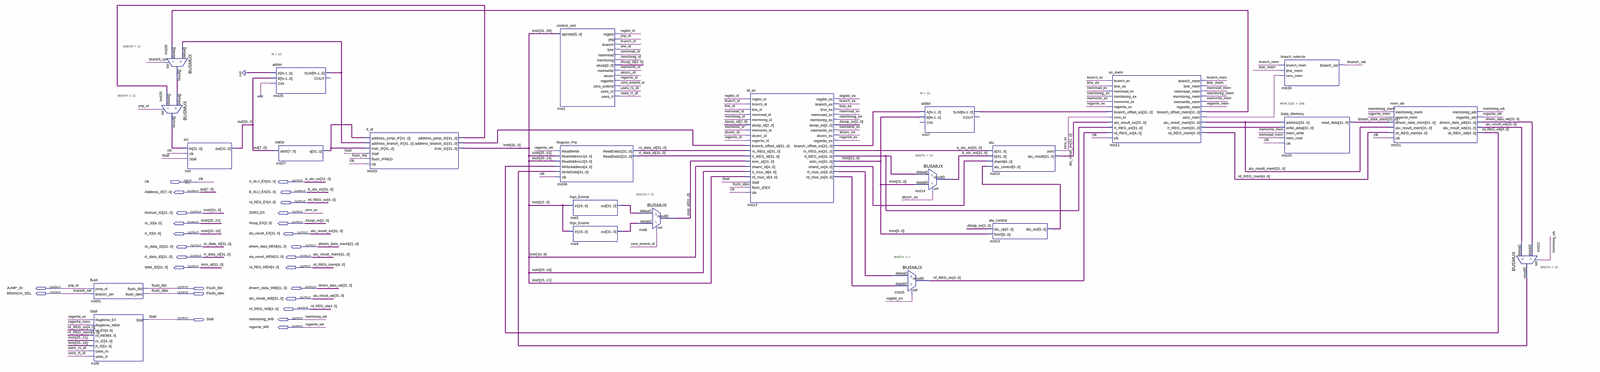
[diagram p0: schematic sheet, whole]
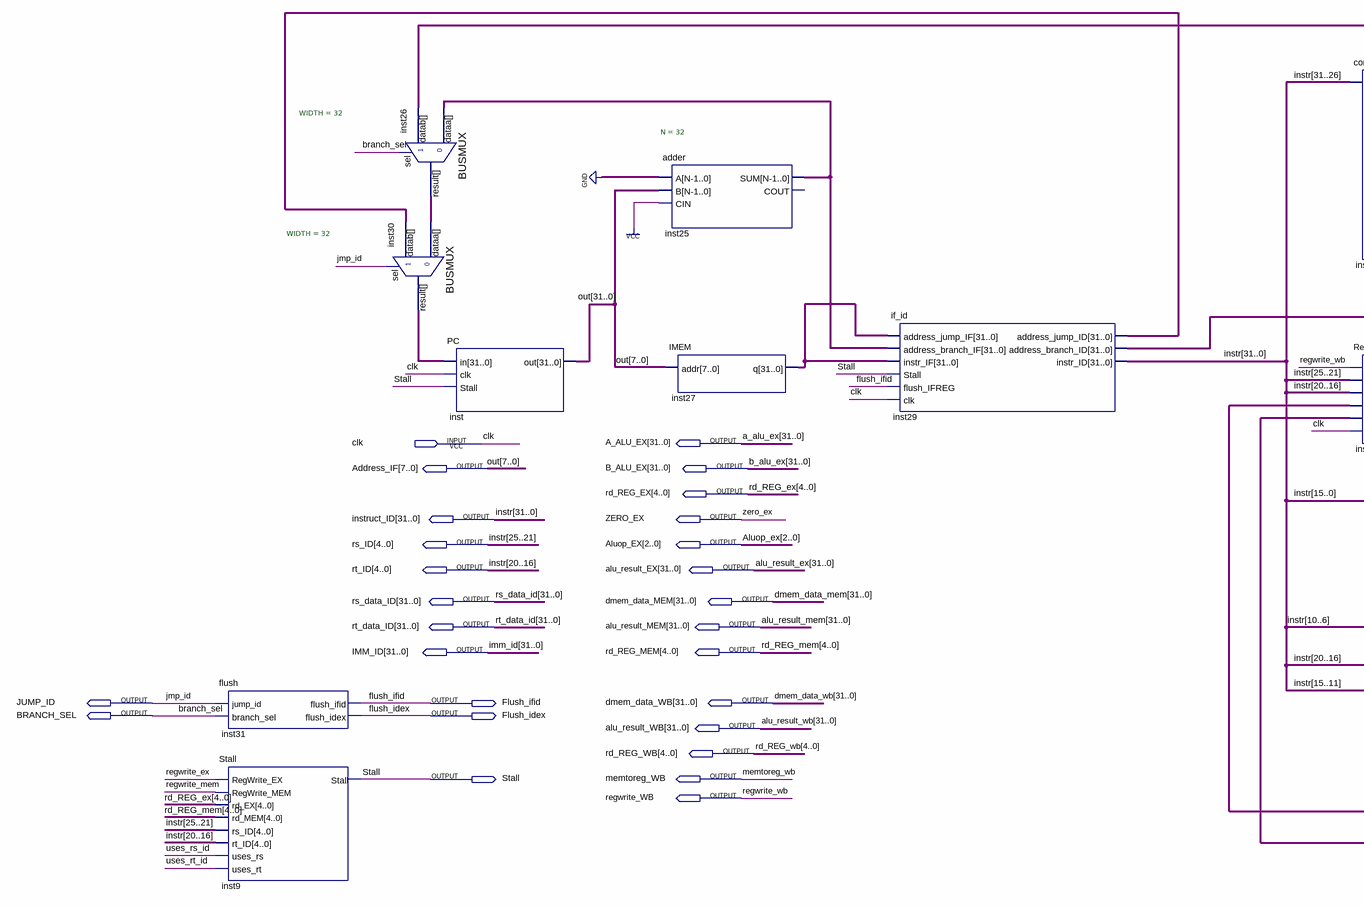
[diagram p1: schematic sheet, left part]
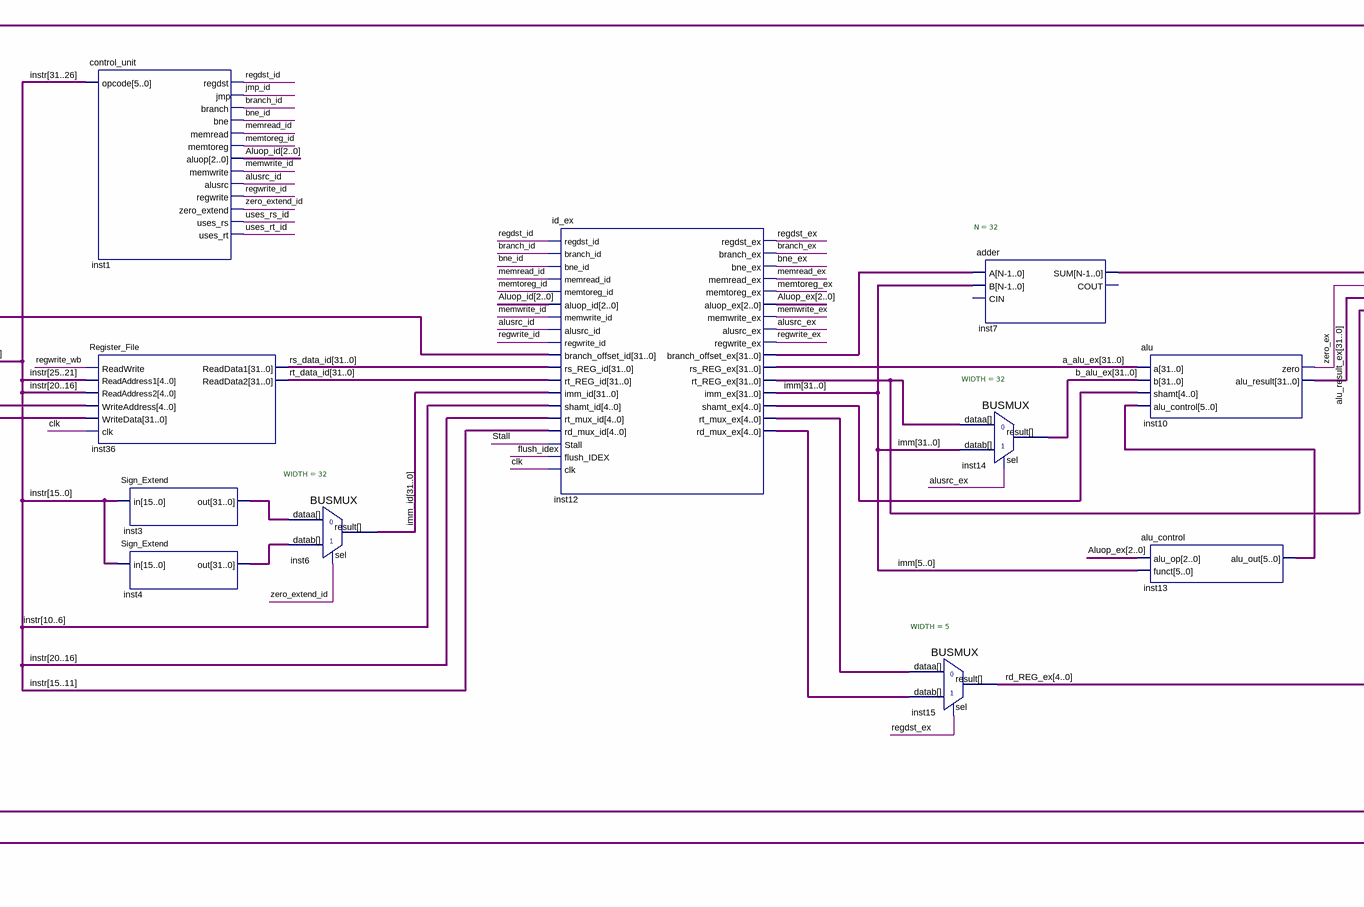
[diagram p2: schematic sheet, centre part]
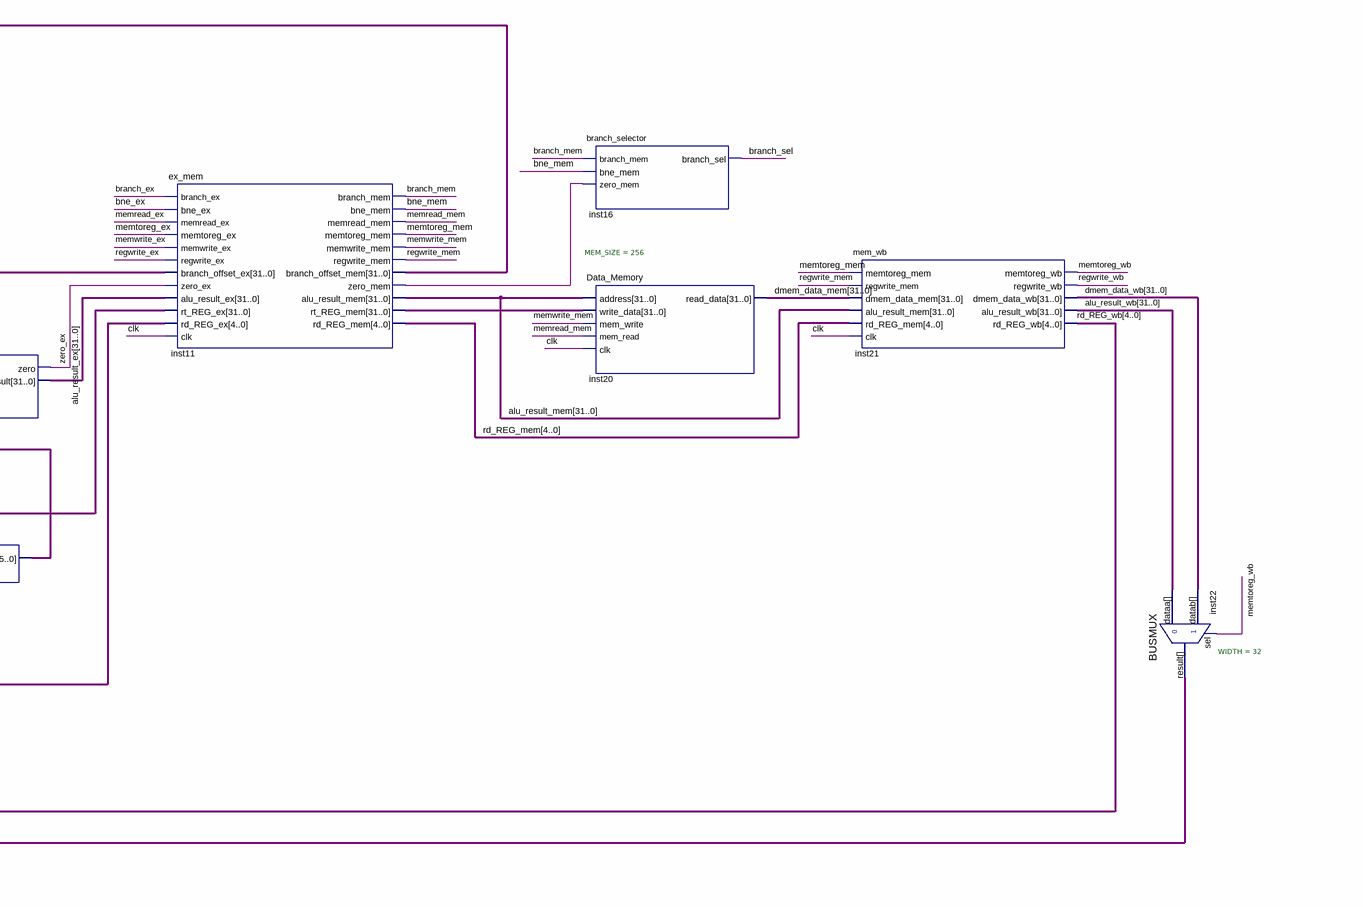
[diagram p3: schematic sheet, right part]
// Quartus schematic mip_datapath.bdf as structural Verilog: 24 symbols, 27 pins
module mip_datapath (
  input  clk,
  output [31:0] A_ALU_EX,
  output [7:0] Address_IF,
  output [31:0] B_ALU_EX,
  output [4:0] rd_REG_EX,
  output [31:0] instruct_ID,
  output ZERO_EX,
  output [4:0] rs_ID,
  output [2:0] Aluop_EX,
  output [4:0] rt_ID,
  output [31:0] alu_result_EX,
  output [31:0] rs_data_ID,
  output [31:0] dmem_data_MEM,
  output [31:0] rt_data_ID,
  output [31:0] alu_result_MEM,
  output [31:0] IMM_ID,
  output [4:0] rd_REG_MEM,
  output JUMP_ID,
  output Flush_ifid,
  output [31:0] dmem_data_WB,
  output BRANCH_SEL,
  output Flush_idex,
  output [31:0] alu_result_WB,
  output [4:0] rd_REG_WB,
  output Stall,
  output memtoreg_WB,
  output regwrite_WB
);

  wire alusrc_ex, alusrc_id, bne_ex, bne_id, bne_mem, branch_ex, branch_id, branch_mem, inst11_zero_mem,
       memread_ex, memread_id, memread_mem, memtoreg_ex, memtoreg_id, memtoreg_mem, memwrite_ex, memwrite_id,
       memwrite_mem, regdst_ex, regdst_id, regwrite_ex, regwrite_id, regwrite_mem, uses_rs_id, uses_rt_id,
       zero_extend_id;
  wire [2:0] Aluop_id;
  wire [4:0] inst12_rd_mux_ex, inst12_rt_mux_ex, inst12_shamt_ex;
  wire [5:0] inst13_alu_out;
  wire [31:0] imm, inst3_out, inst4_out, inst7_sum, inst11_branch_offset_mem, inst11_rt_reg_mem,
       inst12_branch_offset_ex, inst12_rt_reg_ex, inst22_result, inst25_sum, inst26_result, inst27_q,
       inst29_address_branch_id, inst29_address_jump_id, inst30_result;
  wire [31:8] out;

  flush inst31 (.jump_id(JUMP_ID), .branch_sel(BRANCH_SEL), .flush_ifid(Flush_ifid), .flush_idex(Flush_idex));
  Stall inst9 (
    .RegWrite_EX(regwrite_ex), .RegWrite_MEM(regwrite_mem), .rd_EX(rd_REG_EX), .rd_MEM(rd_REG_MEM),
    .rs_ID(instruct_ID[25:21]), .rt_ID(instruct_ID[20:16]), .uses_rs(uses_rs_id), .uses_rt(uses_rt_id),
    .Stall(Stall));
  BUSMUX #(.WIDTH(32)) inst30 (
    .datab(inst29_address_jump_id), .sel(JUMP_ID), .dataa(inst26_result), .result(inst30_result));
  BUSMUX #(.WIDTH(32)) inst26 (
    .datab(inst11_branch_offset_mem), .sel(BRANCH_SEL), .dataa(inst25_sum), .result(inst26_result));
  PC inst (.in(inst30_result), .clk(clk), .Stall(Stall), .out({out, Address_IF}));
  adder #(.N(32)) inst25 (.A({32{1'b0}}), .B({out, Address_IF}), .CIN(1'b1), .SUM(inst25_sum));  // open: COUT
  IMEM inst27 (.addr(Address_IF), .q(inst27_q));
  if_id inst29 (
    .address_jump_IF(inst27_q), .address_branch_IF(inst25_sum), .instr_IF(inst27_q), .Stall(Stall),
    .flush_IFREG(Flush_ifid), .clk(clk), .address_jump_ID(inst29_address_jump_id),
    .address_branch_ID(inst29_address_branch_id), .instr_ID(instruct_ID));
  control_unit inst1 (
    .opcode(instruct_ID[31:26]), .regdst(regdst_id), .jmp(JUMP_ID), .branch(branch_id), .bne(bne_id),
    .memread(memread_id), .memtoreg(memtoreg_id), .aluop(Aluop_id), .memwrite(memwrite_id),
    .alusrc(alusrc_id), .regwrite(regwrite_id), .zero_extend(zero_extend_id), .uses_rs(uses_rs_id),
    .uses_rt(uses_rt_id));
  Register_File inst36 (
    .ReadWrite(regwrite_WB), .ReadAddress1(instruct_ID[25:21]), .ReadAddress2(instruct_ID[20:16]),
    .WriteAddress(rd_REG_WB), .WriteData(inst22_result), .clk(clk), .ReadData1(rs_data_ID),
    .ReadData2(rt_data_ID));
  Sign_Extend inst3 (.in(instruct_ID[15:0]), .out(inst3_out));
  Sign_Extend inst4 (.in(instruct_ID[15:0]), .out(inst4_out));
  BUSMUX #(.WIDTH(32)) inst6 (.datab(inst4_out), .sel(zero_extend_id), .dataa(inst3_out), .result(IMM_ID));
  id_ex inst12 (
    .regdst_id(regdst_id), .branch_id(branch_id), .bne_id(bne_id), .memread_id(memread_id),
    .memtoreg_id(memtoreg_id), .aluop_id(Aluop_id), .memwrite_id(memwrite_id), .alusrc_id(alusrc_id),
    .regwrite_id(regwrite_id), .branch_offset_id(inst29_address_branch_id), .rs_REG_id(rs_data_ID),
    .rt_REG_id(rt_data_ID), .imm_id(IMM_ID), .shamt_id(instruct_ID[10:6]), .rt_mux_id(instruct_ID[20:16]),
    .rd_mux_id(instruct_ID[15:11]), .Stall(Stall), .flush_IDEX(Flush_idex), .clk(clk), .regdst_ex(regdst_ex),
    .branch_ex(branch_ex), .bne_ex(bne_ex), .memread_ex(memread_ex), .memtoreg_ex(memtoreg_ex),
    .aluop_ex(Aluop_EX), .memwrite_ex(memwrite_ex), .alusrc_ex(alusrc_ex), .regwrite_ex(regwrite_ex),
    .branch_offset_ex(inst12_branch_offset_ex), .rs_REG_ex(A_ALU_EX), .rt_REG_ex(inst12_rt_reg_ex),
    .imm_ex(imm), .shamt_ex(inst12_shamt_ex), .rt_mux_ex(inst12_rt_mux_ex), .rd_mux_ex(inst12_rd_mux_ex));
  BUSMUX #(.WIDTH(5)) inst15 (.datab(inst12_rd_mux_ex), .sel(regdst_ex), .dataa(inst12_rt_mux_ex), .result(rd_REG_EX));
  adder #(.N(32)) inst7 (.A(inst12_branch_offset_ex), .B(imm), .SUM(inst7_sum));  // open: CIN, COUT
  BUSMUX #(.WIDTH(32)) inst14 (.datab(imm), .sel(alusrc_ex), .dataa(inst12_rt_reg_ex), .result(B_ALU_EX));
  alu inst10 (
    .a(A_ALU_EX), .b(B_ALU_EX), .shamt(inst12_shamt_ex), .alu_control(inst13_alu_out), .zero(ZERO_EX),
    .alu_result(alu_result_EX));
  alu_control inst13 (.alu_op(Aluop_EX), .funct(imm[5:0]), .alu_out(inst13_alu_out));
  ex_mem inst11 (
    .branch_ex(branch_ex), .bne_ex(bne_ex), .memread_ex(memread_ex), .memtoreg_ex(memtoreg_ex),
    .memwrite_ex(memwrite_ex), .regwrite_ex(regwrite_ex), .branch_offset_ex(inst7_sum), .zero_ex(ZERO_EX),
    .alu_result_ex(alu_result_EX), .rt_REG_ex(inst12_rt_reg_ex), .rd_REG_ex(rd_REG_EX), .clk(clk),
    .branch_mem(branch_mem), .bne_mem(bne_mem), .memread_mem(memread_mem), .memtoreg_mem(memtoreg_mem),
    .memwrite_mem(memwrite_mem), .regwrite_mem(regwrite_mem), .branch_offset_mem(inst11_branch_offset_mem),
    .zero_mem(inst11_zero_mem), .alu_result_mem(alu_result_MEM), .rt_REG_mem(inst11_rt_reg_mem),
    .rd_REG_mem(rd_REG_MEM));
  branch_selector inst16 (
    .branch_mem(branch_mem), .bne_mem(bne_mem), .zero_mem(inst11_zero_mem), .branch_sel(BRANCH_SEL));
  Data_Memory #(.MEM_SIZE(256)) inst20 (
    .address(alu_result_MEM), .write_data(inst11_rt_reg_mem), .mem_write(memwrite_mem),
    .mem_read(memread_mem), .clk(clk), .read_data(dmem_data_MEM));
  mem_wb inst21 (
    .memtoreg_mem(memtoreg_mem), .regwrite_mem(regwrite_mem), .dmem_data_mem(dmem_data_MEM),
    .alu_result_mem(alu_result_MEM), .rd_REG_mem(rd_REG_MEM), .clk(clk), .memtoreg_wb(memtoreg_WB),
    .regwrite_wb(regwrite_WB), .dmem_data_wb(dmem_data_WB), .alu_result_wb(alu_result_WB),
    .rd_REG_wb(rd_REG_WB));
  BUSMUX #(.WIDTH(32)) inst22 (.datab(dmem_data_WB), .sel(memtoreg_WB), .dataa(alu_result_WB), .result(inst22_result));

  assign rs_ID = instruct_ID[25:21];
  assign rt_ID = instruct_ID[20:16];

  // Other names for the same wires on the sheet: instr[31:0] = instruct_ID; jmp_id = JUMP_ID; out[7:0] = Address_IF
endmodule
